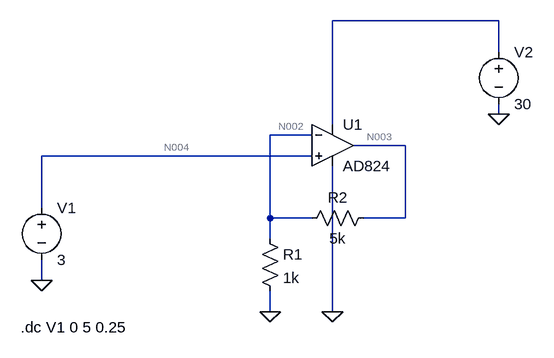
[diagram p0: schematic simple-opamp-gain.asc]
simple-opamp-gain.asc, the LTspice schematic file:
Version 4
SHEET 1 880 680
WIRE 448 -48 192 -48
WIRE 448 0 448 -48
WIRE 448 96 448 80
WIRE 192 112 192 -48
WIRE 160 128 96 128
WIRE 304 144 224 144
WIRE 160 160 -256 160
WIRE -256 240 -256 160
WIRE 96 256 96 128
WIRE 160 256 96 256
WIRE 304 256 304 144
WIRE 304 256 240 256
WIRE 96 288 96 256
WIRE -256 352 -256 320
WIRE 96 400 96 368
WIRE 192 400 192 176
FLAG 96 400 0
FLAG 192 400 0
FLAG -256 352 0
FLAG 448 96 0
SYMBOL Opamps\\AD824 192 80 R0
SYMATTR InstName U1
SYMBOL res 80 272 R0
SYMATTR InstName R1
SYMATTR Value 1k
SYMBOL res 256 240 R90
WINDOW 0 0 56 VBottom 2
WINDOW 3 32 56 VTop 2
SYMATTR InstName R2
SYMATTR Value 5k
SYMBOL voltage -256 224 R0
WINDOW 123 0 0 Left 0
WINDOW 39 0 0 Left 0
SYMATTR InstName V1
SYMATTR Value 3
SYMBOL voltage 448 -16 R0
WINDOW 123 0 0 Left 0
WINDOW 39 0 0 Left 0
SYMATTR InstName V2
SYMATTR Value 30
TEXT -288 424 Left 2 !.dc V1 0 5 0.25

The netlist it stands for:
* simple-opamp-gain.asc
XU1 N004 N002 N001 0 N003 AD824  ; pins In+ In- V+ V- OUT
R1 N002 0 1k
R2 N003 N002 5k
V1 N004 0 3
V2 N001 0 30
.dc V1 0 5 0.25
.backanno
.end

* Results of the author's LTspice run, read from the files saved beside the schematic
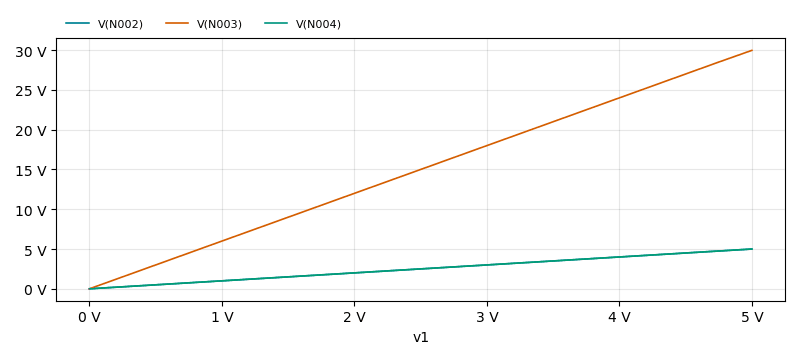
[diagram p1: DC transfer characteristic of simple-opamp-gain.asc, plotted from the saved traces]
* DC transfer characteristic, 1 run:
*   V(N002): 441.1 µV at v1=0 V, 4.995 V at v1=5 V, min 441.1 µV, max 4.995 V
*   V(N003): 2.646 mV at v1=0 V, 29.97 V at v1=5 V, min 2.646 mV, max 29.97 V
*   V(N004): 0 V at v1=0 V, 5 V at v1=5 V, min 0 V, max 5 V